# EAGLE design rf24_nano-shield (EAGLE 6.5.0)
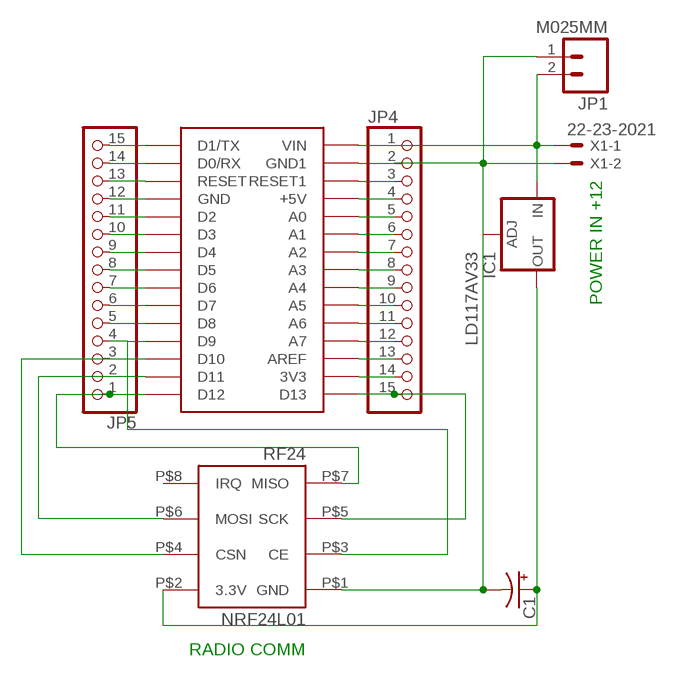
[diagram p0: schematic, sheet 1]

## Parts
C1  CPOL-USTT2D5  [TT2D5]
IC1  LD117AV33  [TO220L1]
JP1  M025MM  [SCREWTERMINAL-5MM-2]
JP4  PINHD-1X15  [1X15]
JP5  PINHD-1X15  [1X15]
NRF24L01  RF24  [4X2HEADER]
U$1  ARDUINONANO  [PDIP-32]
X1  22-23-2021  [22-23-2021]

## Nets
N$1: C1.- IC1.1(ADJ) JP1.1 JP4.2 NRF24L01.P$1(GND) U$1.GND1 X1.2
N$2: C1.+ IC1.2(OUT) NRF24L01.P$2(3.3V)
N$3: JP5.13 U$1.RESET
N$4: JP4.3 U$1.RESET1
N$6: IC1.3(IN) JP1.2 JP4.1 U$1.VIN X1.1
N$7: JP4.4 U$1.+5V
N$8: JP4.5 U$1.A0
N$9: JP4.6 U$1.A1
N$10: JP4.7 U$1.A2
N$11: JP4.8 U$1.A3
N$12: JP4.9 U$1.A4
N$13: JP4.10 U$1.A5
N$14: JP4.11 U$1.A6
N$15: JP4.12 U$1.A7
N$16: JP4.13 U$1.AREF
N$17: JP4.14 U$1.3V3
N$18: JP4.15 NRF24L01.P$5(SCK) U$1.D13
N$19: JP5.1 NRF24L01.P$7(MISO) U$1.D12
N$20: NRF24L01.P$6(MOSI) U$1.D11
N$21: NRF24L01.P$4(CSN) U$1.D10
N$22: JP5.4 NRF24L01.P$3(CE) U$1.D9
N$23: JP5.5 U$1.D8
N$24: JP5.6 U$1.D7
N$25: JP5.7 U$1.D6
N$26: JP5.8 U$1.D5
N$27: JP5.9 U$1.D4
N$28: JP5.10 U$1.D3
N$29: JP5.11 U$1.D2
N$30: JP5.12 U$1.GND
N$31: JP5.14 U$1.D0/RX
N$32: JP5.15 U$1.D1/TX
Unconnected: JP5.2 JP5.3 NRF24L01.P$8(IRQ)

## Notes on the sheet
- POWER IN +12
- RADIO COMM

## Library data of the parts
C1 = adafruit:CPOL-US: POLARIZED CAPACITOR, American symbol
IC1 = v-reg:LD117A?*: Low drop fixed and adjustable positive voltage regulators 1 A Source: http://www.st.com/stonline/products/literature/ds/7194/ld1117axx.pdf
JP1 = SparkFun-Connectors:M02: Standard 2-pin 0.1" header. Use with - straight break away headers ( PRT-00116) - right angle break away headers (PRT-00553) - swiss pins (PRT-00743) - machine pins (PRT-00117) - female headers (PRT-00115) Molex polarized connector foot print use with: PRT-08233 with associated crimp pins and housings. 2.54_SCREWTERM for use with PRT-10571. 3.5mm Screw Terminal footprints for PRT-08084 5mm Screw Terminal footprints for use with PRT-08432; STOREFRONT_ID: PRT-08432
JP4 JP5 = adafruit:PINHD-1X15: PIN HEADER
NRF24L01 = rf24:RF24
U$1 = jet-lib:ARDUINONANO
X1 = con-molex:22-23-2021: .100" (2.54mm) Center Header - 2 Pin; MF: MOLEX; MPN: 22-23-2021; OC_FARNELL: 1462926; OC_NEWARK: 25C3832

## Board
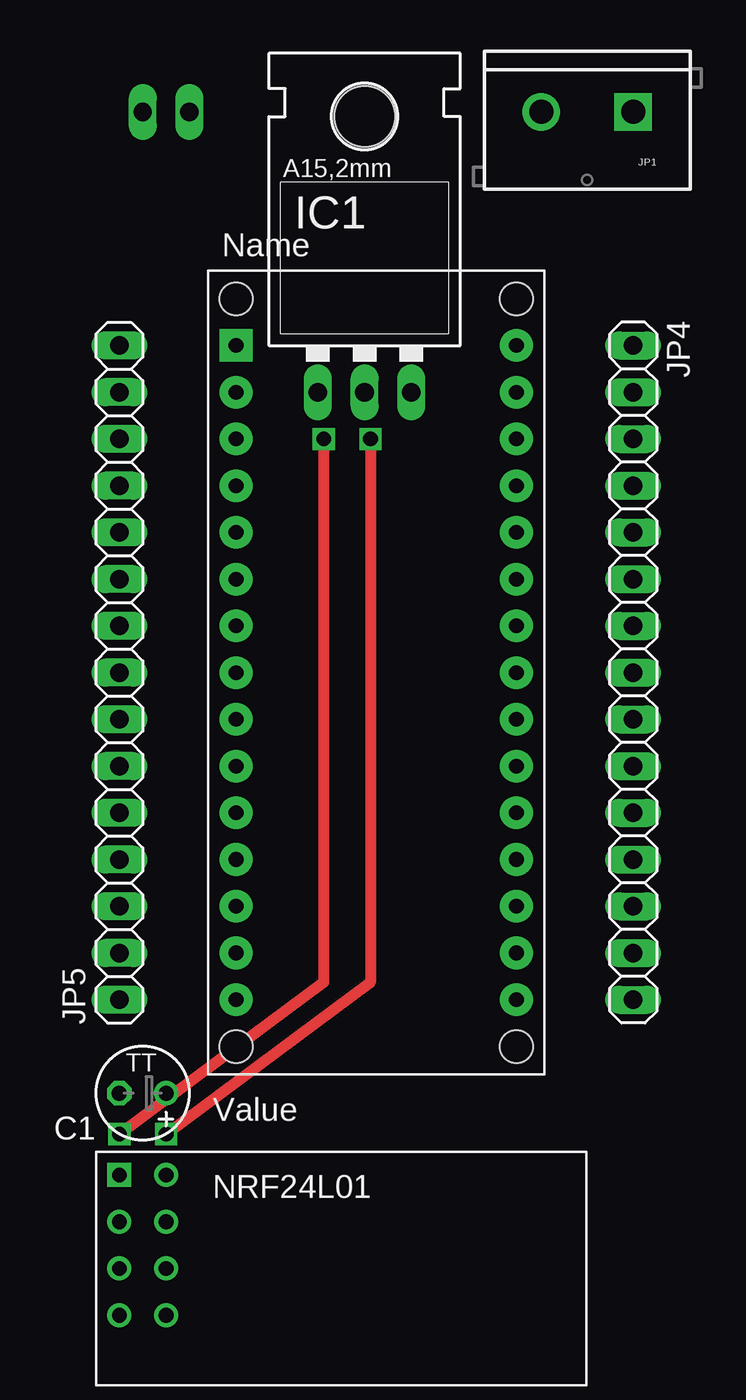
[diagram p1: board, top side]
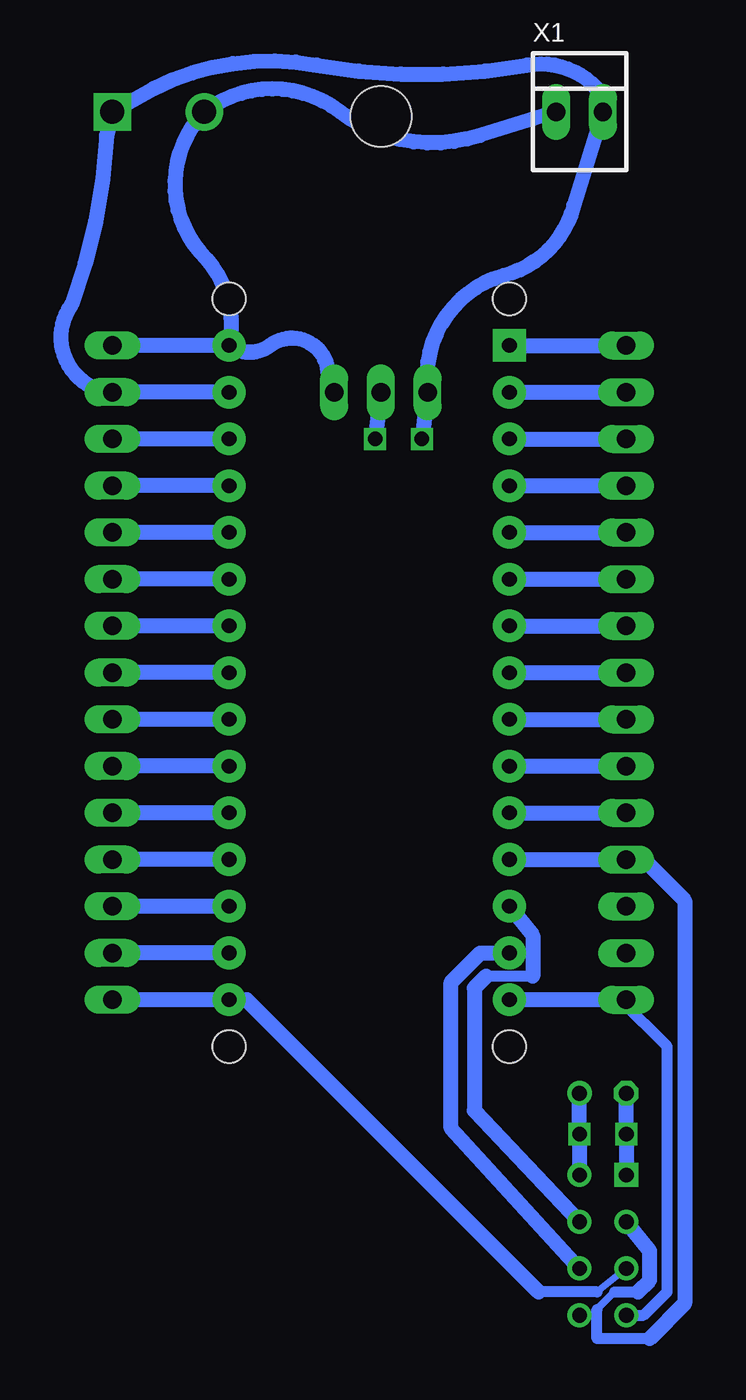
[diagram p2: board, bottom side, seen from below]

No outline drawn. Coordinates in mm, seen from the top.
Copper layers (1*16): Top 0.035mm / dielectric 1.5mm / Bottom 0.035mm
Design rules "default": minimum track width 10mil, minimum drill 24mil, track to track 8mil, track to pad 8mil, pad to pad 8mil, via to via 8mil, smd to smd 8mil, copper to edge 40mil, drill to drill 8mil, minimum pad ring 10mil, minimum via ring 8mil, stop-mask expansion 4mil, vias tented up to drill 0mil, thermal gap 10mil

### Footprints (pad centres in the part's own frame; a part is rotated, then mirrored left to right if it is on the bottom)
TT2D5 = drill 0.813: + -1.27,0 | drill 0.813 octagon: - 1.27,0
TO220L1 = drill 1.016 long: 1 -2.54,-3.81; 2 0,-3.81; 3 2.54,-3.81 | hole 3.302: 0,11.176
SCREWTERMINAL-5MM-2 = drill 1.3 pad 2.032 square: 1 0,0 | drill 1.3 pad 2.032: 2 5,0
1X15 = drill 1.016 long: 1 -17.78,0; 2 -15.24,0; 3 -12.7,0; 4 -10.16,0; 5 -7.62,0; 6 -5.08,0; 7 -2.54,0; 8 0,0; 9 2.54,0; 10 5.08,0; 11 7.62,0; 12 10.16,0; 13 12.7,0; 14 15.24,0; 15 17.78,0
4X2HEADER = drill 0.8 square: P$1 -1.27,3.81 | drill 0.8: P$2 1.27,3.81; P$3 -1.27,1.27; P$4 1.27,1.27; P$5 -1.27,-1.27; P$6 1.27,-1.27; P$7 -1.27,-3.81; P$8 1.27,-3.81
PDIP-32 = drill 0.8 pad 1.778: 3V3 15.24,-35.56; +5V 15.24,-10.16; A0 15.24,-12.7; A1 15.24,-15.24; A2 15.24,-17.78; A3 15.24,-20.32; A4 15.24,-22.86; A5 15.24,-25.4; A6 15.24,-27.94; A7 15.24,-30.48; AREF 15.24,-33.02; D0/RX 0,-5.08; D2 0,-12.7; D3 0,-15.24; D4 0,-17.78; D5 0,-20.32; D6 0,-22.86; D7 0,-25.4; D8 0,-27.94; D9 0,-30.48; D10 0,-33.02; D11 0,-35.56; D12 0,-38.1; D13 15.24,-38.1; GND 0,-10.16; GND1 15.24,-5.08; RESET 0,-7.62; RESET1 15.24,-7.62; VIN 15.24,-2.54 | drill 0.8 pad 1.778 square: D1/TX 0,-2.54 | hole 1.778: 0,0; 0,-40.64; 15.24,-40.64; 15.24,0
22-23-2021 = drill 1 long: 1 -1.27,0; 2 1.27,0

### Placement (x,y rotation side)
C1  5.08,16.51 180 top
IC1  17.14,58.42 0 top
JP1  31.75,69.85 180 top
JP4  31.75,39.37 270 top
JP5  3.81,39.37 90 top
NRF24L01  5.08,8.26 0 top
U$1  10.16,59.69 0 top
X1  6.35,69.85 0 bottom

### Tracks (layer width: path | path; a pad name or v marks a point on that pad's centre or on a via)
N$1  (via drill 0.8)
  Top 0.61: v14.92,52.07 14.92,22.54 v3.81,14.29
  Bottom 0.61: 5.4,71.12 arc86 X1.2
  Bottom 0.813: U$1.GND1 JP4.2 arc122 33.97,59.37 arc-18 32.07,68.58 JP1.1 29.53,71.12 arc37 20.64,72.39 arc-21 9.21,72.39 arc57 5.4,71.12 | X1.2 6.67,64.77 arc62 10.48,60.96 arc-82 IC1.1 v14.92,52.07 | NRF24L01.P$1 v3.81,14.29 C1.-
N$2  (via drill 0.8)
  Top 0.61: v17.46,52.07 17.46,22.54 v6.35,14.29
  Bottom 0.813: IC1.2 v17.46,52.07 | NRF24L01.P$2 v6.35,14.29 C1.+
N$3
  Bottom 0.813: U$1.RESET JP5.13
N$4
  Bottom 0.813: U$1.RESET1 JP4.3
N$6
  Bottom 0.813: U$1.VIN JP4.1 | U$1.VIN arc-58 26.99,62.23 arc85 JP1.2 arc75 19.37,69.85 arc-56 11.75,68.58 X1.1 | IC1.3 20,55.56 arc-127 23.18,57.15 arc74 U$1.VIN
N$7
  Bottom 0.813: U$1.+5V JP4.4
N$8
  Bottom 0.813: U$1.A0 JP4.5
N$9
  Bottom 0.813: U$1.A1 JP4.6
N$10
  Bottom 0.813: U$1.A2 JP4.7
N$11
  Bottom 0.813: U$1.A3 JP4.8
N$12
  Bottom 0.813: U$1.A4 JP4.9
N$13
  Bottom 0.813: U$1.A5 JP4.10
N$14
  Bottom 0.813: U$1.A6 JP4.11
N$15
  Bottom 0.813: U$1.A7 JP4.12
N$16
  Bottom 0.813: U$1.AREF JP4.13
N$17
  Bottom 0.813: U$1.3V3 JP4.14
N$18
  Bottom 0.406: NRF24L01.P$5 5.4,5.71
  Bottom 0.61: 5.4,5.71 8.57,5.71
  Bottom 0.813: 8.57,5.71 24.45,21.59 U$1.D13 JP4.15
N$19
  Bottom 0.406: 4.13,21.59 U$1.D12
  Bottom 0.61: NRF24L01.P$7 2.86,4.45 1.59,5.71 1.59,19.05 4.13,21.59
  Bottom 0.813: JP5.1 U$1.D12
N$20
  Bottom 0.406: NRF24L01.P$6 6.67,7.3
  Bottom 0.813: 6.67,7.3 13.34,14.61 13.34,22.54 11.75,24.13 U$1.D11
N$21
  Bottom 0.61: 8.89,22.86 11.43,22.86
  Bottom 0.813: U$1.D10 8.89,25.08 8.89,22.86 | 11.43,22.86 12.06,22.23 12.06,15.56 NRF24L01.P$4
N$22
  Bottom 0.406: 5.4,4.76 4.45,5.71
  Bottom 0.61: 2.54,3.17 5.4,3.17 5.4,4.76 | 4.45,5.71 3.17,5.71
  Bottom 0.813: U$1.D9 JP5.4 2.86,29.21 0.64,26.99 0.64,5.08 2.54,3.17 | 3.17,5.71 2.54,6.35 2.54,7.94 NRF24L01.P$3
N$23
  Bottom 0.813: U$1.D8 JP5.5
N$24
  Bottom 0.813: U$1.D7 JP5.6
N$25
  Bottom 0.813: U$1.D6 JP5.7
N$26
  Bottom 0.813: U$1.D5 JP5.8
N$27
  Bottom 0.813: U$1.D4 JP5.9
N$28
  Bottom 0.813: U$1.D3 JP5.10
N$29
  Bottom 0.813: U$1.D2 JP5.11
N$30
  Bottom 0.813: U$1.GND JP5.12
N$31
  Bottom 0.813: U$1.D0/RX JP5.14
N$32
  Bottom 0.813: U$1.D1/TX JP5.15